# Altium schematic sheet Filters.SchDoc
size 304 x 431 mm; SheetNumber: 1; SheetTotal: 1; ENG_APP_DATE: --/--/--; DSN_APP_DATE: --/--/--; CHK_APP_DATE: --/--/--
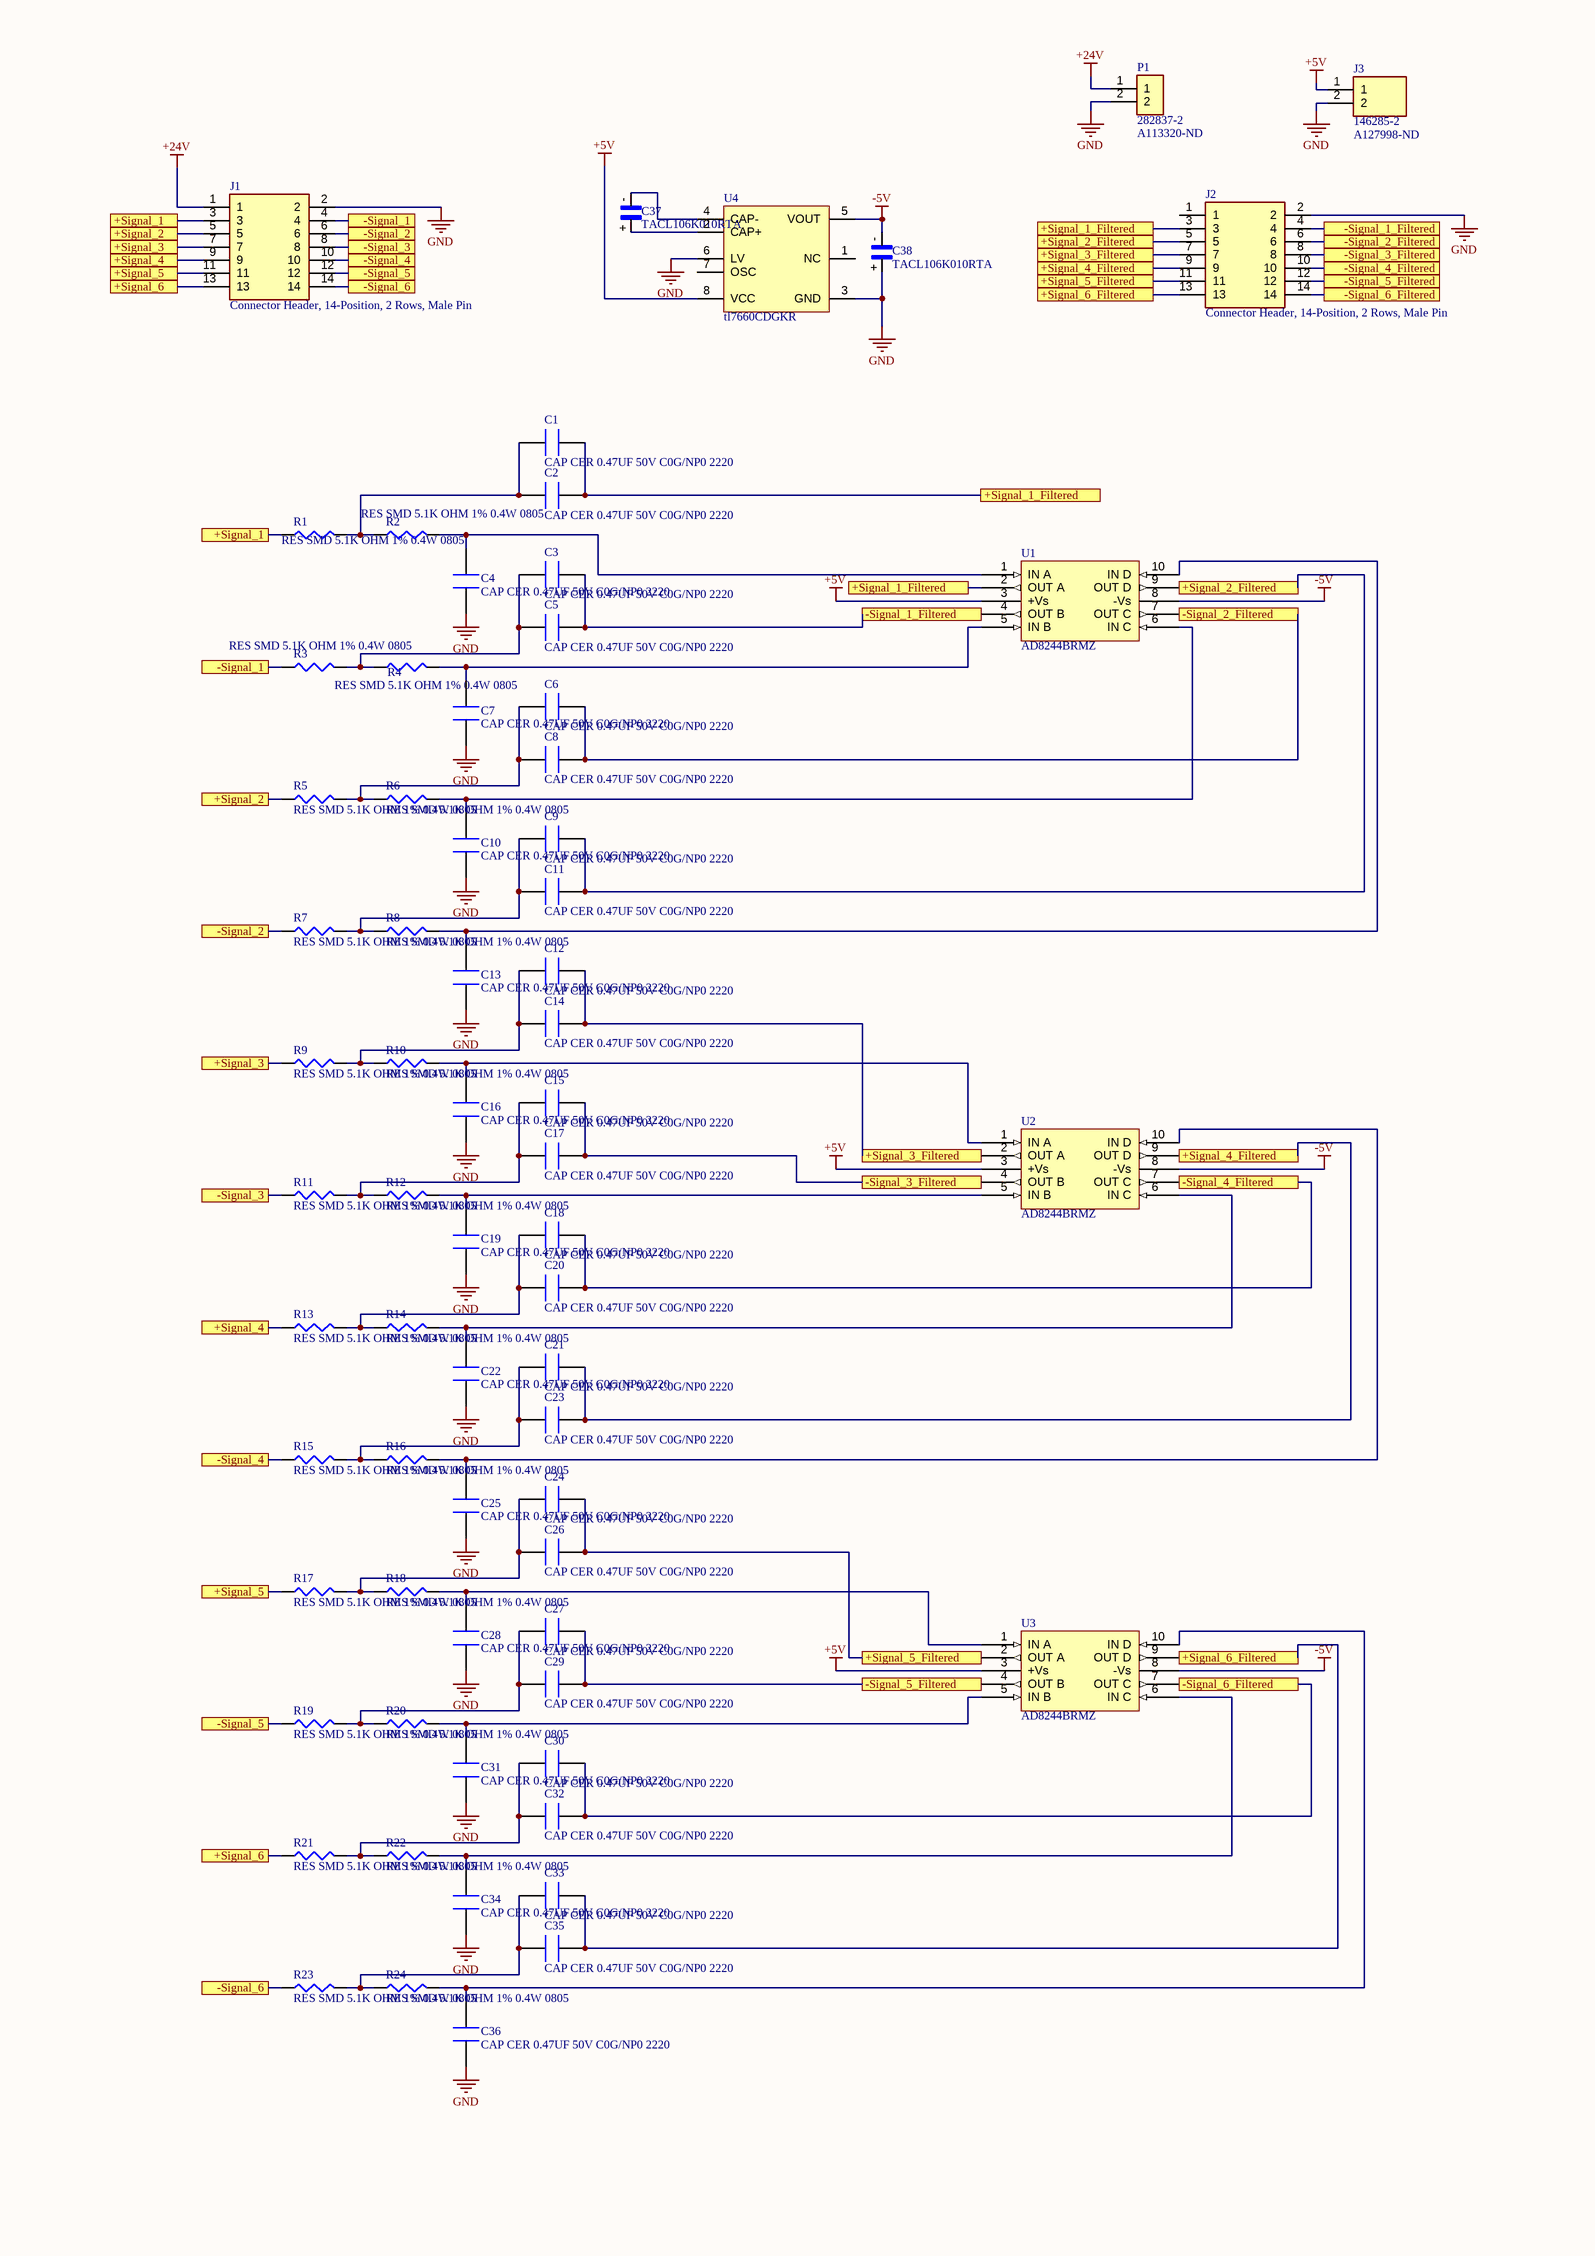
[diagram p0: Filters.SchDoc]

## Parts
C1  CAP CER 0.47UF 50V C0G/NP0 2220  [2220 (5650) Capacitor]
C2  CAP CER 0.47UF 50V C0G/NP0 2220  [2220 (5650) Capacitor]
C3  CAP CER 0.47UF 50V C0G/NP0 2220  [2220 (5650) Capacitor]
C4  CAP CER 0.47UF 50V C0G/NP0 2220  [2220 (5650) Capacitor]
C5  CAP CER 0.47UF 50V C0G/NP0 2220  [2220 (5650) Capacitor]
C6  CAP CER 0.47UF 50V C0G/NP0 2220  [2220 (5650) Capacitor]
C7  CAP CER 0.47UF 50V C0G/NP0 2220  [2220 (5650) Capacitor]
C8  CAP CER 0.47UF 50V C0G/NP0 2220  [2220 (5650) Capacitor]
C9  CAP CER 0.47UF 50V C0G/NP0 2220  [2220 (5650) Capacitor]
C10  CAP CER 0.47UF 50V C0G/NP0 2220  [2220 (5650) Capacitor]
C11  CAP CER 0.47UF 50V C0G/NP0 2220  [2220 (5650) Capacitor]
C12  CAP CER 0.47UF 50V C0G/NP0 2220  [2220 (5650) Capacitor]
C13  CAP CER 0.47UF 50V C0G/NP0 2220  [2220 (5650) Capacitor]
C14  CAP CER 0.47UF 50V C0G/NP0 2220  [2220 (5650) Capacitor]
C15  CAP CER 0.47UF 50V C0G/NP0 2220  [2220 (5650) Capacitor]
C16  CAP CER 0.47UF 50V C0G/NP0 2220  [2220 (5650) Capacitor]
C17  CAP CER 0.47UF 50V C0G/NP0 2220  [2220 (5650) Capacitor]
C18  CAP CER 0.47UF 50V C0G/NP0 2220  [2220 (5650) Capacitor]
C19  CAP CER 0.47UF 50V C0G/NP0 2220  [2220 (5650) Capacitor]
C20  CAP CER 0.47UF 50V C0G/NP0 2220  [2220 (5650) Capacitor]
C21  CAP CER 0.47UF 50V C0G/NP0 2220  [2220 (5650) Capacitor]
C22  CAP CER 0.47UF 50V C0G/NP0 2220  [2220 (5650) Capacitor]
C23  CAP CER 0.47UF 50V C0G/NP0 2220  [2220 (5650) Capacitor]
C24  CAP CER 0.47UF 50V C0G/NP0 2220  [2220 (5650) Capacitor]
C25  CAP CER 0.47UF 50V C0G/NP0 2220  [2220 (5650) Capacitor]
C26  CAP CER 0.47UF 50V C0G/NP0 2220  [2220 (5650) Capacitor]
C27  CAP CER 0.47UF 50V C0G/NP0 2220  [2220 (5650) Capacitor]
C28  CAP CER 0.47UF 50V C0G/NP0 2220  [2220 (5650) Capacitor]
C29  CAP CER 0.47UF 50V C0G/NP0 2220  [2220 (5650) Capacitor]
C30  CAP CER 0.47UF 50V C0G/NP0 2220  [2220 (5650) Capacitor]
C31  CAP CER 0.47UF 50V C0G/NP0 2220  [2220 (5650) Capacitor]
C32  CAP CER 0.47UF 50V C0G/NP0 2220  [2220 (5650) Capacitor]
C33  CAP CER 0.47UF 50V C0G/NP0 2220  [2220 (5650) Capacitor]
C34  CAP CER 0.47UF 50V C0G/NP0 2220  [2220 (5650) Capacitor]
C35  CAP CER 0.47UF 50V C0G/NP0 2220  [2220 (5650) Capacitor]
C36  CAP CER 0.47UF 50V C0G/NP0 2220  [2220 (5650) Capacitor]
C37  TACL106K010RTA  [CAPC1608X90]
C38  TACL106K010RTA  [CAPC1608X90]
J1  Connector Header, 14-Position, 2 Rows, Male Pin  [TE_1-770973-0]
J2  Connector Header, 14-Position, 2 Rows, Male Pin  [TE_1-770973-0]
J3  146285-2  Supplier Part Number 1: A127998-ND  [TE_146285-2]
P1  282837-2  Supplier Part Number 1: A113320-ND  [TE_282837-2]
R1  RES SMD 5.1K OHM 1% 0.4W 0805  [0805 Resistor]
R2  RES SMD 5.1K OHM 1% 0.4W 0805  [0805 Resistor]
R3  RES SMD 5.1K OHM 1% 0.4W 0805  [0805 Resistor]
R4  RES SMD 5.1K OHM 1% 0.4W 0805  [0805 Resistor]
R5  RES SMD 5.1K OHM 1% 0.4W 0805  [0805 Resistor]
R6  RES SMD 5.1K OHM 1% 0.4W 0805  [0805 Resistor]
R7  RES SMD 5.1K OHM 1% 0.4W 0805  [0805 Resistor]
R8  RES SMD 5.1K OHM 1% 0.4W 0805  [0805 Resistor]
R9  RES SMD 5.1K OHM 1% 0.4W 0805  [0805 Resistor]
R10  RES SMD 5.1K OHM 1% 0.4W 0805  [0805 Resistor]
R11  RES SMD 5.1K OHM 1% 0.4W 0805  [0805 Resistor]
R12  RES SMD 5.1K OHM 1% 0.4W 0805  [0805 Resistor]
R13  RES SMD 5.1K OHM 1% 0.4W 0805  [0805 Resistor]
R14  RES SMD 5.1K OHM 1% 0.4W 0805  [0805 Resistor]
R15  RES SMD 5.1K OHM 1% 0.4W 0805  [0805 Resistor]
R16  RES SMD 5.1K OHM 1% 0.4W 0805  [0805 Resistor]
R17  RES SMD 5.1K OHM 1% 0.4W 0805  [0805 Resistor]
R18  RES SMD 5.1K OHM 1% 0.4W 0805  [0805 Resistor]
R19  RES SMD 5.1K OHM 1% 0.4W 0805  [0805 Resistor]
R20  RES SMD 5.1K OHM 1% 0.4W 0805  [0805 Resistor]
R21  RES SMD 5.1K OHM 1% 0.4W 0805  [0805 Resistor]
R22  RES SMD 5.1K OHM 1% 0.4W 0805  [0805 Resistor]
R23  RES SMD 5.1K OHM 1% 0.4W 0805  [0805 Resistor]
R24  RES SMD 5.1K OHM 1% 0.4W 0805  [0805 Resistor]
U1  AD8244BRMZ  [AD8244BRMZ]
U2  AD8244BRMZ  [AD8244BRMZ]
U3  AD8244BRMZ  [AD8244BRMZ]
U4  tl7660CDGKR  [DGK0008A_L]

## Ports
+Signal_1, +Signal_1_Filtered, +Signal_2, +Signal_2_Filtered, +Signal_3, +Signal_3_Filtered, +Signal_4, +Signal_4_Filtered, +Signal_5, +Signal_5_Filtered, +Signal_6, +Signal_6_Filtered, -Signal_1, -Signal_1_Filtered, -Signal_2, -Signal_2_Filtered, -Signal_3, -Signal_3_Filtered, -Signal_4, -Signal_4_Filtered, -Signal_5, -Signal_5_Filtered, -Signal_6, -Signal_6_Filtered

## Nets
+5V: J3.1 U1.3(+Vs) U2.3(+Vs) U3.3(+Vs) U4.8(VCC)
+24V: J1.1 P1.1
-5V: C38.- U1.8(-Vs) U2.8(-Vs) U3.8(-Vs) U4.5(VOUT)
GND: C4.2 C7.2 C10.2 C13.2 C16.2 C19.2 C22.2 C25.2 C28.2 C31.2 C34.2 C36.2 C38.+ J1.2 J2.2 J3.2 P1.2 U4.3(GND) U4.6(LV)
+Signal_1: J1.3 R1.1 ; port +Signal_1
+Signal_1_Filtered: C1.1 C2.1 J2.3 U1.2(OUT_A) ; port +Signal_1_Filtered
+Signal_2: J1.5 R5.1 ; port +Signal_2
+Signal_2_Filtered: C9.2 C11.2 J2.5 U1.9(OUT_D) ; port +Signal_2_Filtered
+Signal_3: J1.7 R9.1 ; port +Signal_3
+Signal_3_Filtered: C12.2 C14.2 J2.7 U2.2(OUT_A) ; port +Signal_3_Filtered
+Signal_4: J1.9 R13.1 ; port +Signal_4
+Signal_4_Filtered: C21.2 C23.2 J2.9 U2.9(OUT_D) ; port +Signal_4_Filtered
+Signal_5: J1.11 R17.1 ; port +Signal_5
+Signal_5_Filtered: C24.2 C26.2 J2.11 U3.2(OUT_A) ; port +Signal_5_Filtered
+Signal_6: J1.13 R21.1 ; port +Signal_6
+Signal_6_Filtered: C33.1 C35.1 J2.13 U3.9(OUT_D) ; port +Signal_6_Filtered
-Signal_1: J1.4 R3.1 ; port -Signal_1
-Signal_1_Filtered: C3.1 C5.1 J2.4 U1.4(OUT_B) ; port -Signal_1_Filtered
-Signal_2: J1.6 R7.1 ; port -Signal_2
-Signal_2_Filtered: C6.2 C8.2 J2.6 U1.7(OUT_C) ; port -Signal_2_Filtered
-Signal_3: J1.8 R11.1 ; port -Signal_3
-Signal_3_Filtered: C15.2 C17.2 J2.8 U2.4(OUT_B) ; port -Signal_3_Filtered
-Signal_4: J1.10 R15.1 ; port -Signal_4
-Signal_4_Filtered: C18.2 C20.2 J2.10 U2.7(OUT_C) ; port -Signal_4_Filtered
-Signal_5: J1.12 R19.1 ; port -Signal_5
-Signal_5_Filtered: C27.2 C29.2 J2.12 U3.4(OUT_B) ; port -Signal_5_Filtered
-Signal_6: J1.14 R23.1 ; port -Signal_6
-Signal_6_Filtered: C30.2 C32.2 J2.14 U3.7(OUT_C) ; port -Signal_6_Filtered
NetC1_2: C1.2 C2.2 R1.2 R2.1
NetC3_2: C3.2 C5.2 R3.2 R4.1
NetC4_1: C4.1 R2.2 U1.1(IN_A)
NetC6_1: C6.1 C8.1 R5.2 R6.1
NetC7_1: C7.1 R4.2 U1.5(IN_B)
NetC9_1: C9.1 C11.1 R7.2 R8.1
NetC10_1: C10.1 R6.2 U1.6(IN_C)
NetC12_1: C12.1 C14.1 R9.2 R10.1
NetC13_1: C13.1 R8.2 U1.10(IN_D)
NetC15_1: C15.1 C17.1 R11.2 R12.1
NetC16_1: C16.1 R10.2 U2.1(IN_A)
NetC18_1: C18.1 C20.1 R13.2 R14.1
NetC19_1: C19.1 R12.2 U2.5(IN_B)
NetC21_1: C21.1 C23.1 R15.2 R16.1
NetC22_1: C22.1 R14.2 U2.6(IN_C)
NetC24_1: C24.1 C26.1 R17.2 R18.1
NetC25_1: C25.1 R16.2 U2.10(IN_D)
NetC27_1: C27.1 C29.1 R19.2 R20.1
NetC28_1: C28.1 R18.2 U3.1(IN_A)
NetC30_1: C30.1 C32.1 R21.2 R22.1
NetC31_1: C31.1 R20.2 U3.5(IN_B)
NetC33_2: C33.2 C35.2 R23.2 R24.1
NetC34_1: C34.1 R22.2 U3.6(IN_C)
NetC36_1: C36.1 R24.2 U3.10(IN_D)
NetC37_+: C37.+ U4.2(CAP+)
NetC37_-: C37.- U4.4(CAP-)

Not connected (* = marked no-connect by the designer): J2 1; U4 1(NC) 7(OSC)

## Notes on the sheet
- DWG. NO.
- REV.
- SHT.
- THIS DOCUMENT AND THE DATA DISCLOSED HEREIN OR HEREWITH IS THE PROPERTY OF ALTIUM LIMITED AND MAY BE FREELY DISTRIBUTED IN WHOLE. NO RIGHTS ARE RESERVED OR EXPRESS OR IMPLIED WARANTEE GIVEN.
- REVISION
- DESCRIPTION
- DATE
- APPROVED
- ENG:
- APPROVALS
- PROJECT
- DSN:
- CHK:
- REFERENCE DOCUMENTS
- PROJECT REVISION:
- TITLE
- DOCUMENT REVISION:
- DESIGN ITEM:
- BOM:
- FAB DWG:
- PCB DWG:
- ASSY DWG:
- SCALE:
- SIZE
- B
- CAGE CODE
- FILE NAME
- DWG NO.
- SHEET
- OF
- REV

## Library data of the parts
C1-C36 = CAP CER 0.47UF 50V C0G/NP0 2220: Cap Ceramic 0.47uF 50V C0G 5% SMD 2220 125°C Embossed Plastic T/R; Manufacturer: KEMET; Manufacturer Part Number: C2220C474J5GACAUTO; Capacitance: 470nF; Supplier 1: Digi-Key; Supplier Part Number 1: 399-C2220C474J5GACAUTOCT-ND; RoHS: Yes; Category: Ceramic Capacitors; Stock 1: 950; Pricing 1: 1=4.64000, 10=3.74400, 50=3.21940, 100=2.92000, 500=2.17128 (USD); Case/Package: 2220; Dielectric Material: Ceramic; Voltage Rating (DC): 50V; Tolerance: 5%; Lead Free: Lead Free; RoHS Compliant: Yes; ComponentLink1URL: http://www.farnell.com/datasheets/2747618.pdf?src-supplier=Farnell; ComponentLink1Description: http://www.farnell.com/datasheets/2747618.pdf?src-supplier=Farnell; Supplier 2: Digi-Key; Supplier Part Number 2: 399-C2220C474J5GACAUTODKR-ND; Stock 2: 950; Pricing 2: 1=4.64000, 10=3.74400, 50=3.21940, 100=2.92000, 500=2.17128 (USD); Supplier 3: Mouser; Supplier Part Number 3: 80-C2220C474J5GAUTO; Stock 3: 1000; Pricing 3: 1=4.64000, 10=3.75000, 50=3.22000, 100=2.91000, 1000=2.48000, 10000=2.48000 (USD)
C37 C38 = TACL106K010RTA: Cap Tant Solid 10uF 10V L CASE 10% (1.6 X 0.85 X 0.85mm) SMD 1608-10 7.5 Ohm 125°C Plastic T/R; Manufacturer: Kyocera AVX; Dielectric Material: Tantalum; ESR (Equivalent Series Resistance): 7.5R; Leakage Current: 1uA; Dissipation Factor: 20%; Polarity: Polar; Package: None; Price: None; Value: *; MP: TACL106K010RTA; Availability: Unavailable; Supplier 1: Digi-Key; Supplier Part Number 1: 478-TACL106K010RTACT-ND; Manufacturer Part Number: TACL106K010RTA; RoHS: Yes; Category: Tantalum Capacitors; Stock 1: 3500; Pricing 1: 1=2.54000, 10=2.05600, 50=1.79400, 100=1.56980, 500=1.19600, 1000=1.04650 (USD); Case/Package: Conformal Coated; Number of Pins: 2; Case Code (Imperial): 0603; Case Code (Metric): 1608; Min Operating Temperature: -55°C; Max Operating Temperature: 125°C; Capacitance: 10uF; Tolerance: 10%; Package Quantity: 3500; Voltage Rating: 10V; Packaging: Tape and Reel; Voltage Rating (DC): 10V; Termination: SMD/SMT; Voltage: 10V; Series: TAC; Construction: Flat; Length: 1.6mm; Width: 0.85mm; Height: 0.85mm; Lead Pitch: 0.55mm; Depth: 0.85mm; Radiation Hardening: No; RoHS Compliant: Yes; ComponentLink1URL: https://datasheet.ciiva.com/11219/tac-11219455.pdf?src-supplier=Avnet; ComponentLink1Description: https://datasheet.ciiva.com/11219/tac-11219455.pdf?src-supplier=Avnet; ComponentLink2URL: https://datasheet.ciiva.com/12907/tac-12907781.pdf?src-supplier=Mouser; ComponentLink2Description: https://datasheet.ciiva.com/12907/tac-12907781.pdf?src-supplier=Mouser; ComponentLink3URL: https://datasheet.ciiva.com/14598/70001310-14598278.pdf?src-supplier=Allied+Electronics; ComponentLink3Description: https://datasheet.ciiva.com/14598/70001310-14598278.pdf?src-supplier=Allied+Electronics; Supplier 2: Digi-Key; Supplier Part Number 2: 478-TACL106K010RTADKR-ND; Stock 2: 3500; Pricing 2: 1=2.54000, 10=2.05600, 50=1.79400, 100=1.56980, 500=1.19600, 1000=1.04650 (USD); Supplier 3: Digi-Key; Supplier Part Number 3: 478-TACL106K010RTATR-ND; Stock 3: 3500; Pricing 3: 3500=1.00913 (USD)
J1 J2 = 1-770973-0: Connector Header, 14-Position, 2 Rows, Male Pin, PCB, White, Mate-N-Lok Series; Manufacturer: TE Connectivity; MF: {'manufacturer': 'TE Connectivity'}; Number of Terminals/Pins: 14; Current Rating: 9.5A; Insulation Resistance: 100MR; Connector System: Wire-to-Board; Mating Alignment: Yes (With); PCB Mount Alignment: No (Without); PCB Mount Retention: With; Max Voltage Rating (AC): 600V; Number of Ports: 1; Test Voltage: 1.5kV; Circuit Application: Power; VDE Tested: Yes; Pitch: 0.162inch; Row Spacing: 0.163inch; Plating Thickness: 8.89um; PCB Thickness: 1.57inch; Approvals: CSA; Value: *; Availability: Unavailable; Package: None; MP: 1-770973-0; Price: None; Supplier 1: Digi-Key; Supplier Part Number 1: A32482-ND; Manufacturer Part Number: 1-770973-0; RoHS: Yes; Category: Power Connectors; Stock 1: 583; Pricing 1: 1=6.69000, 10=6.05100, 100=5.29790, 500=4.46140, 1000=3.90372 (USD); Mount: Through Hole,Board; Color: White; Contact Plating: Tin; Contact Material: Brass; Housing Material: Nylon; Housing Color: White; Min Operating Temperature: -67°C; Max Operating Temperature: 221°C; Packaging: Bag; Package Quantity: 200; Termination: Solder; Orientation: Right Angle; Series: Mini-Universal MATE-N-LOK; Number of Rows: 2; Contact Gender: Male; Number of Positions: 14; Number of Contacts: 14; Connector Type: Pin; Mating Retention: Yes (With); Contact Current Rating: 9.5A; Contact Type: Male Pin; Number of Poles: 14; Fastening Type: Ramp; Voltage Rating: 600V; Contact Retention: No (Without); Number of Power Positions: 14; Sealable: No (Without); Strain Relief: No (Without); Length: 30.56mm; Width: 12.7mm; Height: 11.86mm; Radiation Hardening: No; REACH SVHC: Unknown; Flammability Rating: UL94 V-0; RoHS Compliant: Yes; ComponentLink1URL: https://datasheet.ciiva.com/19460/1963239-19460794.pdf?src-supplier=Jameco; ComponentLink1Description: https://datasheet.ciiva.com/19460/1963239-19460794.pdf?src-supplier=Jameco; ComponentLink2URL: https://datasheet.ciiva.com/1111/eng-cd-770973-g-1111842.pdf?src-supplier=Element14; ComponentLink2Description: https://datasheet.ciiva.com/1111/eng-cd-770973-g-1111842.pdf?src-supplier=Element14; ComponentLink3URL: https://datasheet.ciiva.com/710/eng-cd-770973-h-710742.pdf?src-supplier=Digi-Key; ComponentLink3Description: https://datasheet.ciiva.com/710/eng-cd-770973-h-710742.pdf?src-supplier=Digi-Key; ComponentLink4URL: https://datasheet.ciiva.com/16654/eng-cs-82181-softshell-high-density-0408-16654873.pdf?src-supplier=Avnet+Europe; ComponentLink4Description: https://datasheet.ciiva.com/16654/eng-cs-82181-softshell-high-density-0408-16654873.pdf?src-supplier=Avnet+Europe; Supplier 2: Newark; Supplier Part Number 2: 52K3387; Stock 2: 272; Pricing 2: 1=6.19000, 10=5.42000, 25=5.24000, 50=5.07000, 100=4.89000, 250=4.38000 (USD); Supplier 3: Mouser; Supplier Part Number 3: 571-1-770973-0; Stock 3: 1677; Pricing 3: 1=6.37000, 10=5.58000, 50=5.58000, 100=5.05000, 200=4.51000, 600=4.24000, 1000=3.71000, 2600=3.53000, 5000=3.45000, 10000=3.36000 (USD)
P1 = 282837-2: Connector Terminal Blocks Receptacle 2 Position 5.08mm Solder Straight Thru-Hole 13.5A/Contact; MF: TE Connectivity; Price: None; Check_prices: https://www.snapeda.com/parts/282837-2/TE%20Connectivity%20AMP%20Connectors/view-part/2549980/?ref=eda; Package: None; Purchase-URL: https://pricing.snapeda.com/search/part/282837-2/?ref=eda; SnapEDA_Link: https://www.snapeda.com/parts/282837-2/TE%20Connectivity%20AMP%20Connectors/view-part/2549980/?ref=snap; Value: *; MP: 282837-2; Availability: Good; Supplier 1: Digi-Key
R1-R24 = RES SMD 5.1K OHM 1% 0.4W 0805: Res Thick Film 0805 5.1kOhm 1% 2/5W ±100ppm/K Molded Paper T/R; Manufacturer: Vishay Dale; Manufacturer Part Number: RCS08055K10FKEA; Resistance: 5.1kR; Max Power Dissipation: 400mW; Temperature Coefficient: 100ppm/°C; Supplier 1: Digi-Key; Supplier Part Number 1: 541-RCS08055K10FKEACT-ND; RoHS: Yes; Category: Chip SMD Resistors; Stock 1: 3307; Pricing 1: 1=0.26000, 10=0.21800, 100=0.08510, 1000=0.03560, 2500=0.03264 (USD); Case/Package: 0805; Min Operating Temperature: -55°C; Max Operating Temperature: 155°C; Package Quantity: 5000; Packaging: Tape and Reel; Resistor Type: Thick Film; Number of Terminations: 2; Tolerance: 1%; Features: Automotive AEC-Q200; Length: 0.079inch; Width: 0.049inch; Height: 0.02inch; ComponentLink1URL: http://www.vishay.com/docs/20065/rcse3.pdf?src-supplier=Digi-Key; ComponentLink1Description: http://www.vishay.com/docs/20065/rcse3.pdf?src-supplier=Digi-Key; Supplier 2: Digi-Key; Supplier Part Number 2: 541-RCS08055K10FKEADKR-ND; Stock 2: 3307; Pricing 2: 1=0.26000, 10=0.21800, 100=0.08510, 1000=0.03560, 2500=0.03264 (USD); Supplier 3: Mouser; Supplier Part Number 3: 71-RCS08055K10FKEA; Stock 3: 1182; Pricing 3: 1=0.26000, 10=0.21800, 50=0.21800, 100=0.08600, 1000=0.03600, 10000=0.03400 (USD)
U1-U3 = AD8244BRMZ: Op Amp Quad Low Power Amplifier R-R O/P ±18V/36V 10-Pin MSOP Tube; Manufacturer: Analog Devices; Min Supply Voltage: 3V; Max Supply Voltage: 36V; Min Dual Supply Voltage: 1.5V; Max Dual Supply Voltage: 18V; Voltage Gain: 0dB; Number of Circuits: 4; Slew Rate: 0.8V/µs; -3db Bandwidth: 3MHz; Input Bias Current: 0.5pA; Input Offset Voltage (Vos): 350uV; Operating Supply Current: 180uA; Output Current per Channel: 8mA; Common Mode Rejection Ratio: 61.8dB; Input Capacitance: 3.3pF; Nominal Supply Current: 2.5mA; Power Supply Rejection Ratio (PSRR): 90dB; Settling Time: 18us; Bandwidth: 3.6MHz; Max Frequency: 1kHz; Supplier 1: Digi-Key; Manufacturer Part Number: AD8244BRMZ; RoHS: Yes; Category: Amplifiers - Op Amps, Buffer, Instrumentation; Stock 1: 3; Pricing 1: 1=7.39000, 10=6.67700, 25=6.36680, 100=5.52830, 250=5.27984, 500=4.83450 (USD); Mount: Surface Mount; Case/Package: MSOP; Number of Pins: 10; Min Operating Temperature: -40°C; Max Operating Temperature: 85°C; Packaging: Rail/Tube; Gain Bandwidth Product: 3MHz; Quiescent Current: 180uA; Number of Amplifiers: 4; Length: 3.1mm; Width: 3.1mm; Height: 0.95mm; Lead Free: Contains Lead; REACH SVHC: No SVHC; ComponentLink1URL: https://datasheet.ciiva.com/29970/ad8244-29970485.pdf?src-supplier=Avnet; ComponentLink1Description: https://datasheet.ciiva.com/29970/ad8244-29970485.pdf?src-supplier=Avnet; Supplier 2: Mouser; Stock 2: 351; Pricing 2: 1=7.40000, 10=6.68000, 50=6.36000, 100=5.52000, 1000=4.39000, 10000=4.39000 (USD); Supplier 3: RSComponents; Stock 3: 500; Pricing 3: 10=5.95000, 20=5.56500 (GBP); Supplier Part Number 2: 584-AD8244BRMZ; Supplier Part Number 1: 505-AD8244BRMZ-ND; Supplier Part Number 3: 1831998P
U4 = TI-7660-8: CMOS Voltage Converter 8-VSSOP -40 to 85; Manufacturer: Texas Instruments; Synchronous Rectifier: No; Number of Outputs: 1; Max Input Voltage: 10V; Output Type: Adjustable; Quiescent Current: 110uA; Nominal Supply Current: 120uA; Output Voltage: 20V; Switching Frequency: 9kHz; Min Supply Voltage: 1.5V; Output Current: 20uA; Logic Function: Inverting; ComponentLink2URL: https://datasheet.ciiva.com/2025/tl7660-2025569.pdf?src-supplier=Digi-Key; Stock 4: 2412; Category: Voltage Regulators - Switching; Radiation Hardening: No; Number of Channels: 1; Stock 5: 1398; ComponentLink1Description: https://datasheet.ciiva.com/15114/getdatasheetpartid-256695-15114098.pdf?src-supplier=Verical; Stock 2: 3670; Series: -; Lead Free: Lead Free; RoHS: Yes; Pricing 3: 2500=1.00450 (USD); Weight: 0.000935oz; Pricing 1: 1=1.79000, 10=1.61200, 25=1.52120, 100=1.29600, 250=1.21688, 500=1.06476, 1000=1.00450 (USD); Min Operating Temperature: -40°C; Packaging: Tape and Reel; Supply Current: 120uA; ComponentLink3Description: https://datasheet.ciiva.com/2025/tl7660-2025570.pdf?src-supplier=Digi-Key; Pricing 5: 1=1.79000, 10=1.62000, 25=1.53000, 50=1.53000, 100=1.30000, 250=1.22000, 500=1.07000, 1000=0.88300, 10000=0.88300 (USD); Manufacturer Part Number: TL7660CDGKR; Package Quantity: 1; Stock 1: 3670; Max Operating Temperature: 125°C; Contact Plating: Gold; Pricing 2: 1=1.79000, 10=1.61200, 25=1.52120, 100=1.29600, 250=1.21688, 500=1.06476, 1000=1.00450 (USD); ComponentLink1URL: https://datasheet.ciiva.com/15114/getdatasheetpartid-256695-15114098.pdf?src-supplier=Verical; Width: 3mm; ComponentLink3URL: https://datasheet.ciiva.com/2025/tl7660-2025570.pdf?src-supplier=Digi-Key; Max Supply Voltage: 10V; ComponentLink2Description: https://datasheet.ciiva.com/2025/tl7660-2025569.pdf?src-supplier=Digi-Key; Stock 3: 2500; ComponentLink4URL: https://datasheet.ciiva.com/2025/tl7660-2025571.pdf?src-supplier=Digi-Key; ComponentLink4Description: https://datasheet.ciiva.com/2025/tl7660-2025571.pdf?src-supplier=Digi-Key; RoHS Compliant: Yes; Number of Pins: 8; Pricing 4: 1=1.72270, 10=1.54570, 25=1.47060, 100=1.22500, 250=1.13670, 500=0.99630, 1000=0.81540 (USD); Case/Package: VSSOP; Supplier 1: Digi-Key; Supplier Part Number 1: 296-TL7660CDGKRCT-ND; Supplier 2: Digi-Key; Supplier Part Number 2: 296-TL7660CDGKRDKR-ND; Supplier 3: Digi-Key; Supplier Part Number 3: 296-TL7660CDGKRTR-ND; Supplier 4: Arrow Electronics; Supplier Part Number 4: TL7660CDGKR; Supplier 5: Mouser; Supplier Part Number 5: 595-TL7660CDGKR
J3 = 146285-2: Package: None; Price: None; Value: *; MP: 146285-2; Availability: Unavailable; Supplier 1: Digi-Key